# EAGLE design cigar_mic (EAGLE 7.1.0)
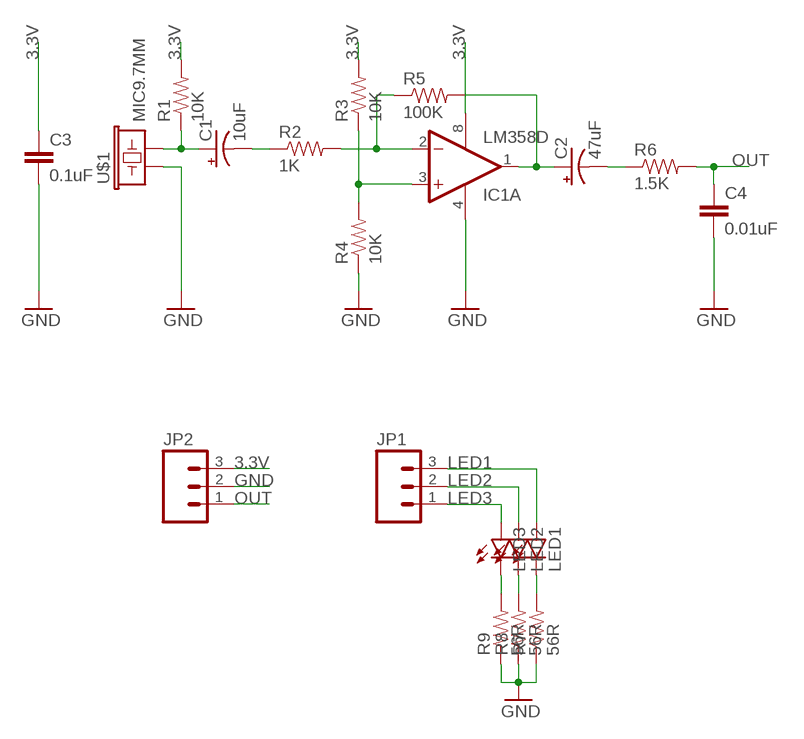
[diagram p0: schematic, sheet 1]

## Parts
C1  10uF  SURFACEMTPOLAR  [POLAR]
C2  47uF  SURFACEMTPOLAR  [POLAR]
C3  0.1uF  CAP0805  [0805]
C4  0.01uF  CAP0805  [0805]
IC1  LM358D  [SO08]
JP1  M031X03_NO_SILK  [1X03_NO_SILK]
JP2  M031X03_NO_SILK  [1X03_NO_SILK]
LED1  LED0603  [LED-0603]
LED2  LED0603  [LED-0603]
LED3  LED0603  [LED-0603]
R1  10K  RESISTOR0603  [0603-RES]
R2  1K  RESISTOR0603  [0603-RES]
R3  10K  RESISTOR0603  [0603-RES]
R4  10K  RESISTOR0603  [0603-RES]
R5  100K  RESISTOR0603  [0603-RES]
R6  1.5K  RESISTOR0603  [0603-RES]
R7  56R  RESISTOR0603  [0603-RES]
R8  56R  RESISTOR0603  [0603-RES]
R9  56R  RESISTOR0603  [0603-RES]
U$1  MIC9.7MM  [MIC-9.7MM]

## Nets
3.3V: C3.1 IC1.8(P:V+) JP2.3 R1.2 R3.2
GND: C3.2 C4.2 IC1.4(P:V-) JP2.2 R4.1 R7.1 R8.1 R9.1 U$1.1
LED1: JP1.3 LED1.A
LED2: JP1.2 LED2.A
LED3: JP1.1 LED3.A
N$1: C1.P$1(+) R1.1 U$1.2
N$2: C1.P$2(-) R2.1
N$3: IC1.2(A:-IN) R2.2 R5.1
N$4: IC1.3(A:+IN) R3.1 R4.2
N$5: C2.P$1(+) IC1.1(A:OUT) R5.2
N$6: C2.P$2(-) R6.1
N$8: LED3.C R9.2
N$9: LED2.C R8.2
N$10: LED1.C R7.2
OUT: C4.1 JP2.1 R6.2
Unconnected: IC1.5(B:+IN) IC1.6(B:-IN) IC1.7(B:OUT)

## Library data of the parts
C1 C2 = IDEO-Capacitors:SURFACEMT
C3 C4 = SparkFun-Capacitors:CAP: Capacitor Standard 0603 ceramic capacitor, and 0.1" leaded capacitor.
IC1 = linear:LM358: OP AMP also LM158; LM258; LM2904 Source: http://cache.national.com/ds/LM/LM158.pdf
JP1 JP2 = SparkFun-Connectors:M03: Header 3 Standard 3-pin 0.1" header. Use with straight break away headers (SKU : PRT-00116), right angle break away headers (PRT-00553), swiss pins (PRT-00743), machine pins (PRT-00117), and female headers (PRT-00115). Molex polarized connector foot print use with SKU : PRT-08232 with associated crimp pins and housings.
LED1-LED3 = SparkFun-LED:LED: LEDs Standard schematic elements and footprints for 5mm, 3mm, 1206, and 0603 sized LEDs. 5mm - Spark Fun Electronics SKU : COM-00529 (and others)
R1-R9 = SparkFun-Resistors:RESISTOR: Resistor Basic schematic elements and footprints for 0603, 1206, and PTH resistors.
U$1 = SparkFun-Sensors:MIC: Omni-directional electret microphone. 9.7mm standard diameter.; PROD_ID: COMP-08856

## Board
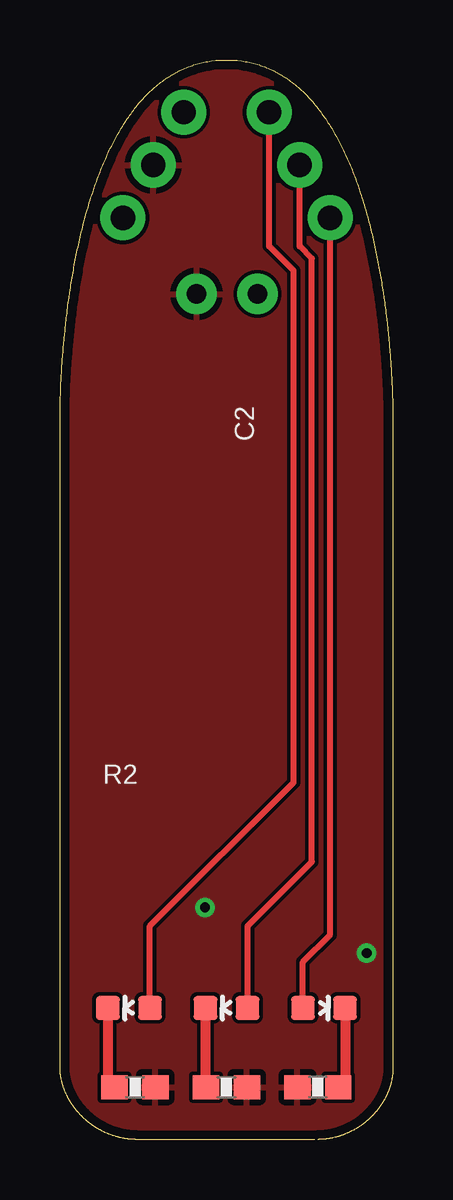
[diagram p1: board, top side]
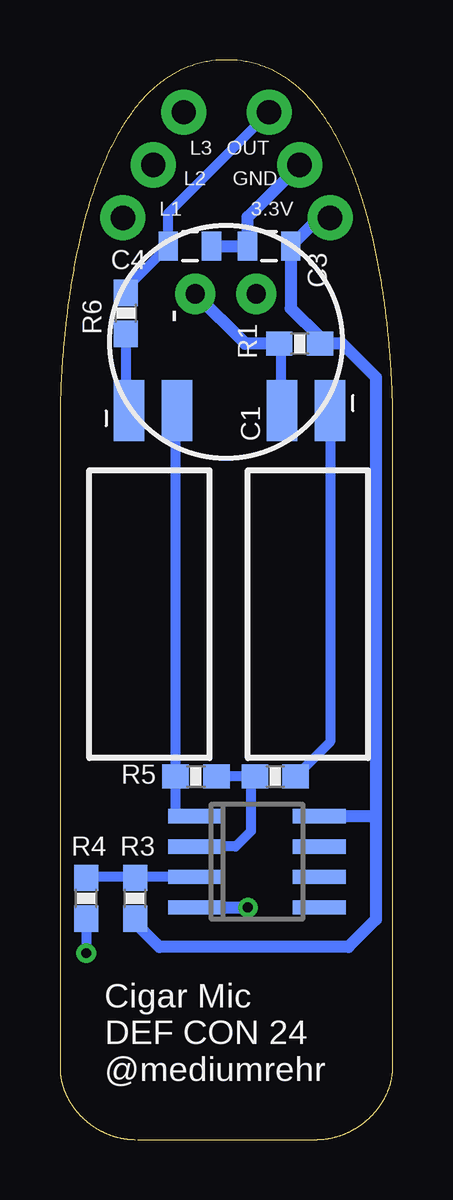
[diagram p2: board, bottom side, seen from below]

Size 13.87 x 45 mm. Coordinates in mm from the lower left corner, seen from the top.
Outline: 10.62,0 3.16,0 3.13,0 3.11,0 3.08,0 3.06,0 3.03,0 3,0.01 2.98,0.01 2.95,0.01 2.93,0.01 2.9,0.01 2.88,0.02 2.85,0.02 2.83,0.02 2.8,0.03 2.77,0.03 2.75,0.03 2.72,0.04 2.7,0.04 2.67,0.04 2.65,0.05 2.62,0.05 2.6,0.06 2.55,0.07 2.52,0.07 2.5,0.08 2.47,0.09 2.45,0.09 2.42,0.1 2.4,0.11 2.37,0.11 2.35,0.12 2.33,0.13 2.3,0.13 2.25,0.15 2.23,0.16 2.2,0.16 2.18,0.17 2.16,0.18 2.11,0.2 2.08,0.21 2.06,0.22 2.04,0.23 2.01,0.24 1.99,0.25 1.97,0.26 1.94,0.27 1.9,0.29 1.87,0.3 1.85,0.31 1.83,0.32 1.8,0.33 1.76,0.35 1.74,0.36 1.71,0.38 1.69,0.39 1.67,0.4 1.65,0.41 1.62,0.43 1.6,0.44 1.58,0.45 1.56,0.46 1.54,0.48 1.49,0.5 1.47,0.52 1.45,0.53 1.43,0.55 1.41,0.56 1.39,0.57 1.37,0.59 1.34,0.6 1.3,0.63 1.28,0.65 1.26,0.66 1.24,0.68 1.22,0.69 1.2,0.71 1.18,0.73 1.16,0.74 1.14,0.76 1.12,0.77 1.1,0.79 1.08,0.81 1.07,0.82 1.05,0.84 1.01,0.88 0.99,0.89 0.97,0.91 0.95,0.93 0.93,0.94 0.92,0.96 0.9,0.98 0.88,1 0.86,1.02 0.85,1.04 0.83,1.05 0.79,1.09 0.78,1.11 0.76,1.13 0.74,1.15 0.73,1.17 0.71,1.19 0.69,1.21 0.68,1.22 0.66,1.24 0.65,1.26 0.63,1.28 0.62,1.3 0.6,1.32 0.59,1.34 0.57,1.37 0.56,1.39 0.54,1.41 0.53,1.43 0.51,1.45 0.5,1.47 0.48,1.49 0.47,1.51 0.46,1.53 0.43,1.57 0.42,1.6 0.41,1.62 0.39,1.64 0.38,1.66 0.37,1.68 0.36,1.7 0.34,1.73 0.33,1.75 0.32,1.77 0.31,1.79 0.3,1.82 0.29,1.84 0.28,1.86 0.25,1.91 0.24,1.93 0.22,1.98 0.21,2 0.2,2.02 0.2,2.05 0.19,2.07 0.18,2.09 0.17,2.12 0.16,2.14 0.14,2.19 0.14,2.21 0.13,2.24 0.12,2.26 0.11,2.28 0.11,2.31 0.1,2.33 0.09,2.36 0.09,2.38 0.08,2.41 0.07,2.43 0.07,2.45 0.06,2.48 0.06,2.5 0.05,2.53 0.05,2.55 0.04,2.58 0.04,2.6 0.03,2.63 0.03,2.65 0.02,2.7 0.02,2.73 0.02,2.75 0.01,2.78 0.01,2.8 0.01,2.83 0.01,2.86 0.01,2.88 0,2.93 0,2.96 0,2.98 0,3.01 0,3.04 0,29.85 0,29.93 0,30.01 0,30.09 0,30.17 0,30.26 0,30.34 0.01,30.42 0.01,30.51 0.01,30.59 0.01,30.68 0.01,30.77 0.02,30.85 0.02,30.94 0.02,31.03 0.03,31.12 0.03,31.21 0.03,31.3 0.04,31.39 0.04,31.48 0.05,31.67 0.05,31.76 0.06,31.86 0.07,31.95 0.07,32.05 0.08,32.14 0.08,32.24 0.09,32.34 0.1,32.43 0.1,32.53 0.11,32.63 0.12,32.73 0.13,32.83 0.13,32.93 0.14,33.03 0.15,33.13 0.16,33.23 0.17,33.33 0.18,33.43 0.19,33.53 0.21,33.73 0.22,33.84 0.23,33.94 0.24,34.04 0.26,34.15 0.27,34.25 0.28,34.35 0.29,34.46 0.31,34.56 0.32,34.67 0.33,34.77 0.35,34.88 0.36,34.98 0.38,35.09 0.41,35.3 0.42,35.4 0.44,35.51 0.46,35.61 0.47,35.72 0.49,35.83 0.51,35.93 0.53,36.04 0.54,36.14 0.56,36.25 0.58,36.35 0.6,36.46 0.62,36.57 0.64,36.67 0.66,36.78 0.69,36.88 0.71,36.99 0.73,37.09 0.75,37.2 0.77,37.3 0.8,37.41 0.82,37.51 0.85,37.62 0.89,37.82 0.92,37.93 0.95,38.03 0.97,38.14 1,38.24 1.05,38.44 1.08,38.55 1.14,38.75 1.17,38.85 1.2,38.95 1.23,39.05 1.26,39.15 1.29,39.25 1.32,39.35 1.35,39.45 1.42,39.65 1.45,39.74 1.49,39.84 1.52,39.94 1.56,40.03 1.59,40.13 1.63,40.22 1.67,40.32 1.7,40.41 1.74,40.51 1.78,40.6 1.82,40.69 1.86,40.78 1.9,40.87 1.94,40.96 1.98,41.05 2.02,41.14 2.06,41.23 2.1,41.32 2.15,41.41 2.19,41.49 2.23,41.58 2.28,41.66 2.32,41.75 2.37,41.83 2.42,41.91 2.46,42 2.51,42.08 2.56,42.16 2.61,42.24 2.66,42.32 2.7,42.39 2.81,42.55 2.86,42.62 2.91,42.7 2.96,42.77 3.01,42.84 3.07,42.91 3.12,42.98 3.18,43.05 3.29,43.19 3.35,43.26 3.4,43.32 3.46,43.39 3.52,43.45 3.58,43.51 3.64,43.57 3.7,43.63 3.76,43.69 3.82,43.75 3.88,43.81 3.95,43.86 4.01,43.92 4.07,43.97 4.14,44.02 4.21,44.07 4.27,44.12 4.34,44.17 4.41,44.22 4.47,44.26 4.54,44.31 4.61,44.35 4.68,44.4 4.75,44.44 4.83,44.48 4.9,44.51 4.97,44.55 5.04,44.59 5.12,44.62 5.19,44.65 5.27,44.68 5.35,44.71 5.42,44.74 5.5,44.77 5.58,44.8 5.66,44.82 5.74,44.84 5.82,44.87 5.9,44.88 5.98,44.9 6.07,44.92 6.15,44.93 6.23,44.95 6.32,44.96 6.49,44.98 6.58,44.99 6.76,45 6.84,45 7.03,45 7.12,45 7.29,44.99 7.38,44.98 7.55,44.96 7.64,44.95 7.72,44.93 7.81,44.92 7.89,44.9 7.97,44.88 8.05,44.87 8.13,44.84 8.29,44.8 8.37,44.77 8.45,44.74 8.53,44.71 8.6,44.68 8.68,44.65 8.75,44.62 8.83,44.59 8.9,44.55 8.97,44.51 9.05,44.48 9.12,44.44 9.19,44.4 9.26,44.35 9.33,44.31 9.4,44.26 9.46,44.22 9.53,44.17 9.6,44.12 9.67,44.07 9.73,44.02 9.8,43.97 9.86,43.92 9.92,43.86 9.99,43.81 10.05,43.75 10.11,43.69 10.17,43.63 10.23,43.57 10.29,43.51 10.35,43.45 10.41,43.39 10.47,43.32 10.53,43.26 10.58,43.19 10.64,43.12 10.69,43.05 10.75,42.98 10.8,42.91 10.86,42.84 10.91,42.77 11.01,42.62 11.07,42.55 11.12,42.47 11.17,42.39 11.22,42.32 11.26,42.24 11.31,42.16 11.36,42.08 11.41,42 11.46,41.91 11.5,41.83 11.59,41.66 11.64,41.58 11.68,41.49 11.72,41.41 11.77,41.32 11.81,41.23 11.85,41.14 11.89,41.05 11.97,40.87 12.01,40.78 12.05,40.69 12.09,40.6 12.13,40.51 12.17,40.41 12.2,40.32 12.24,40.22 12.28,40.13 12.31,40.03 12.35,39.94 12.38,39.84 12.42,39.74 12.45,39.65 12.52,39.45 12.55,39.35 12.58,39.25 12.61,39.15 12.64,39.05 12.67,38.95 12.7,38.85 12.73,38.75 12.79,38.55 12.82,38.44 12.87,38.24 12.9,38.14 12.92,38.03 12.95,37.93 12.98,37.82 13,37.72 13.03,37.62 13.05,37.51 13.07,37.41 13.1,37.3 13.12,37.2 13.16,36.99 13.19,36.88 13.21,36.78 13.23,36.67 13.25,36.57 13.27,36.46 13.29,36.35 13.31,36.25 13.33,36.14 13.34,36.04 13.36,35.93 13.38,35.83 13.4,35.72 13.42,35.61 13.43,35.51 13.45,35.4 13.46,35.3 13.49,35.09 13.51,34.98 13.52,34.88 13.54,34.77 13.55,34.67 13.57,34.56 13.58,34.46 13.59,34.35 13.62,34.15 13.63,34.04 13.64,33.94 13.65,33.84 13.66,33.73 13.67,33.63 13.68,33.53 13.69,33.43 13.7,33.33 13.71,33.23 13.72,33.13 13.73,33.03 13.74,32.93 13.75,32.83 13.75,32.73 13.76,32.63 13.77,32.53 13.77,32.43 13.78,32.34 13.79,32.24 13.79,32.14 13.8,32.05 13.81,31.95 13.81,31.86 13.82,31.76 13.82,31.67 13.83,31.48 13.83,31.39 13.84,31.3 13.84,31.21 13.85,31.12 13.85,31.03 13.85,30.94 13.85,30.85 13.86,30.77 13.86,30.68 13.86,30.59 13.86,30.51 13.87,30.42 13.87,30.34 13.87,30.26 13.87,30.17 13.87,30.09 13.87,30.01 13.87,29.93 13.87,29.85 13.87,2.98 13.87,2.96 13.87,2.93 13.87,2.91 13.87,2.88 13.87,2.86 13.87,2.83 13.86,2.81 13.86,2.78 13.86,2.76 13.86,2.73 13.85,2.68 13.85,2.66 13.84,2.63 13.84,2.61 13.84,2.58 13.83,2.56 13.83,2.53 13.82,2.51 13.82,2.48 13.81,2.46 13.81,2.44 13.8,2.41 13.8,2.39 13.79,2.36 13.79,2.34 13.78,2.31 13.77,2.29 13.77,2.27 13.76,2.24 13.75,2.22 13.74,2.2 13.74,2.17 13.73,2.15 13.72,2.13 13.71,2.1 13.71,2.08 13.7,2.06 13.69,2.03 13.68,2.01 13.67,1.99 13.66,1.96 13.65,1.94 13.64,1.92 13.63,1.9 13.62,1.87 13.61,1.85 13.6,1.83 13.59,1.81 13.58,1.78 13.57,1.76 13.56,1.74 13.53,1.7 13.52,1.68 13.51,1.65 13.5,1.63 13.49,1.61 13.46,1.57 13.45,1.55 13.43,1.53 13.42,1.5 13.41,1.48 13.38,1.44 13.37,1.42 13.35,1.4 13.34,1.38 13.32,1.36 13.31,1.34 13.29,1.32 13.28,1.3 13.26,1.28 13.25,1.26 13.23,1.24 13.22,1.22 13.2,1.2 13.19,1.18 13.17,1.17 13.16,1.15 13.14,1.13 13.12,1.11 13.11,1.09 13.09,1.07 13.07,1.05 13.06,1.04 13.04,1.02 13.02,1 13,0.98 12.99,0.96 12.97,0.95 12.95,0.93 12.93,0.91 12.92,0.89 12.9,0.88 12.88,0.86 12.86,0.84 12.84,0.83 12.82,0.81 12.8,0.79 12.79,0.78 12.77,0.76 12.75,0.75 12.73,0.73 12.71,0.71 12.69,0.7 12.67,0.68 12.65,0.67 12.63,0.65 12.61,0.64 12.59,0.62 12.55,0.59 12.53,0.58 12.49,0.55 12.47,0.54 12.42,0.51 12.4,0.5 12.38,0.48 12.36,0.47 12.34,0.46 12.3,0.43 12.27,0.42 12.25,0.41 12.23,0.39 12.21,0.38 12.19,0.37 12.16,0.36 12.14,0.35 12.12,0.34 12.1,0.32 12.08,0.31 12.03,0.29 12.01,0.28 11.98,0.27 11.96,0.26 11.94,0.25 11.92,0.24 11.89,0.23 11.87,0.22 11.85,0.21 11.82,0.2 11.8,0.2 11.78,0.19 11.75,0.18 11.73,0.17 11.7,0.16 11.68,0.15 11.66,0.15 11.63,0.14 11.61,0.13 11.58,0.12 11.56,0.12 11.54,0.11 11.51,0.1 11.49,0.1 11.46,0.09 11.44,0.08 11.39,0.07 11.37,0.07 11.34,0.06 11.32,0.06 11.29,0.05 11.27,0.05 11.24,0.04 11.22,0.04 11.19,0.04 11.17,0.03 11.14,0.03 11.12,0.03 11.09,0.02 11.07,0.02 11.04,0.02 11.02,0.01 10.99,0.01 10.97,0.01 10.94,0.01 10.92,0.01 10.89,0 10.87,0 10.84,0 10.82,0 10.79,0 10.77,0 10.74,0
Copper layers (1*16): Top 0.035559375mm / dielectric 1.501140625mm / Bottom 0.035559375mm
Design rules "typical_4pcb": minimum track width 10mil, minimum drill 15mil, track to track 6mil, track to pad 6mil, pad to pad 6mil, via to via 6mil, smd to smd 6mil, copper to edge 15mil, drill to drill 8mil, minimum pad ring 10mil, minimum via ring 8mil, stop-mask expansion 4mil, vias tented up to drill 0mil, thermal gap 10mil

### Footprints (pad centres in the part's own frame; a part is rotated, then mirrored left to right if it is on the bottom)
POLAR = smd 2.54 x 1.27: P$1 0,2; P$2 0,0
0805 = smd 0.8 x 1.2: 1 -0.9,0; 2 0.9,0
SO08 = smd 0.6 x 2.2: 1 -1.905,-2.6; 2 -0.635,-2.6; 3 0.635,-2.6; 4 1.905,-2.6; 5 1.905,2.6; 6 0.635,2.6; 7 -0.635,2.6; 8 -1.905,2.6
1X03_NO_SILK = drill 1.016 pad 1.88: 1 0,0; 2 2.54,0; 3 5.08,0
LED-0603 = smd 1 x 1: A 0,-0.877; C 0,0.877
0603-RES = smd 1.1 x 1: 1 -0.85,0; 2 0.85,0
MIC-9.7MM = drill 0.8 pad 1.676: 1 -2,1.27; 2 -2,-1.27

### Placement (x,y rotation side)
C1  2.62,30.38 90 bottom
C2  11,30.38 270 bottom
C3  5.16,37.24 180 bottom
C4  8.46,37.24 0 bottom
IC1  5.67,11.58 270 bottom
JP1  8.71,42.82 300 top
JP2  5.16,42.82 240 top
LED1  11,5.49 270 top
LED2  6.94,5.49 90 top
LED3  2.87,5.49 90 top
R1  3.89,33.17 0 bottom
R2  4.9,15.14 180 bottom
R3  10.75,10.06 270 bottom
R4  12.78,10.06 90 bottom
R5  8.21,15.14 180 bottom
R6  750R  [0603-RES]  11.13,34.44 90 bottom
R7  10.75,2.18 0 top
R8  6.94,2.18 180 top
R9  3.13,2.18 180 top
U$1  6.96,33.25 270 bottom

### Tracks (layer width: path | path; a pad name or v marks a point on that pad's centre or on a via)
3.3V
  Bottom 0.406: 10.75,9.04 R3.2
  Bottom 0.508: 0.71,13.49 0.71,31.77 2.11,33.17 R1.2 3.04,33.43 4.26,34.65 C3.1 3.07,38.42 JP2.3 | 0.71,13.49 0.71,9.17 1.86,8.03 9.73,8.03 10.75,9.04 | IC1.8 0.71,13.49
GND  (via drill 0.41)
  Bottom 0.406: R4.1 v12.78,7.77
  Bottom 0.508: IC1.4 v6.05,9.68 | C4.2 C3.2 6.06,38.45 JP2.2
  pour Top: -0.68,45.62 -0.68,-0.1 14.56,-0.1 14.56,45.62
LED1
  Top 0.254: LED1.A 10.12,7.4 11.25,8.53 JP1.3
LED2
  Top 0.254: LED2.A 7.81,8.9 10.49,11.58 10.49,36.73 9.98,37.24 JP1.2
LED3
  Top 0.254: LED3.A 3.75,8.9 9.73,14.88 9.73,36.22 8.71,37.24 JP1.1
N$1
  Bottom 0.406: R1.1 4.67,33.17 4.67,31.16 4.62,31.11 C1.P$1
  Bottom 0.508: R1.1 6.15,33.17 U$1.2
N$2
  Bottom 0.406: C1.P$2 2.62,16.57 R2.1
N$3
  Bottom 0.406: R5.1 R2.2 5.75,14.97 5.92,14.97 5.92,12.85 6.55,12.22 IC1.2
N$4
  Bottom 0.406: IC1.3 10.75,10.95 | 10.75,10.95 12.78,10.95 R4.2 | R3.1 10.75,10.95
N$5
  Bottom 0.406: 8.04,13.49 IC1.1 9.06,13.49 R5.2 9.06,30.58 C2.P$1
N$6
  Bottom 0.406: R6.1 11.13,30.76 C2.P$2
N$8
  Top 0.406: LED3.C 1.99,2.21 R9.2
N$9
  Top 0.406: LED2.C 6.06,2.21 R8.2
N$10
  Top 0.406: LED1.C 11.88,2.21 R7.2
OUT
  Bottom 0.406: R6.2 11.13,35.47 C4.1 9.36,38.62 JP2.1

### Text on the board
bPlace: OUT | L3 | GND | L2 | 3.3V | L1 | Cigar Mic / DEF CON 24 / @mediumrehr